# EAGLE design Luminode_Controller_Mark_II (EAGLE 6.6.0)
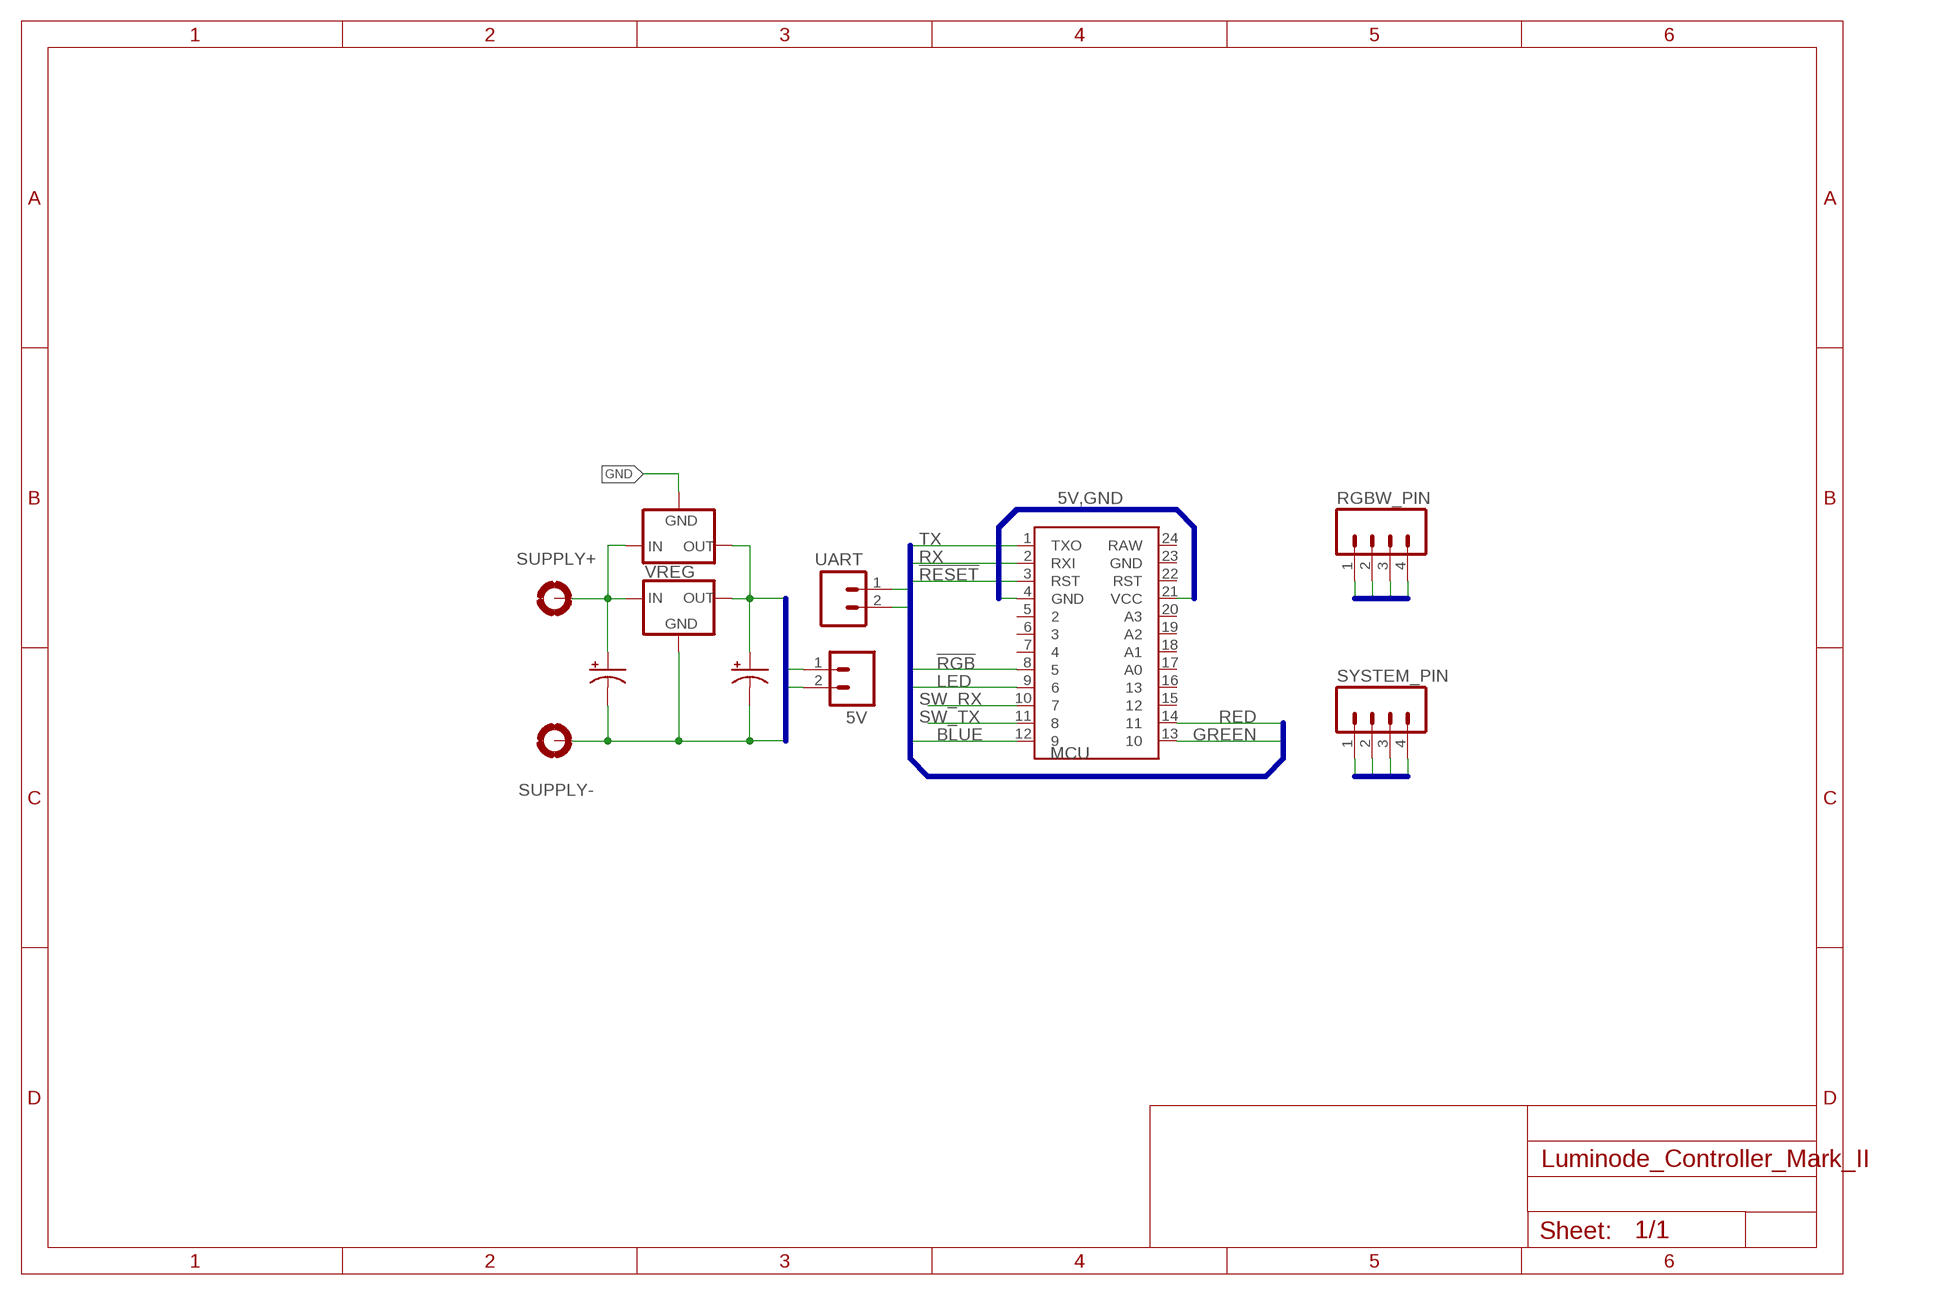
[diagram p0: schematic, sheet 1]

## Parts
5V  M02PTH  [1X02]
C_IN  CPOL-USSMCB  [SMC_B]
C_OUT  CPOL-USSMCB  [SMC_B]
MCU  ARDUINO_MINI  [ARDUINO_MINI]
RGBW_PIN  M04PTH  [1X04]
SUPPLY+  +V  MOUNT-PAD-ROUND3.0  [3,0-PAD]
SUPPLY-  -V  MOUNT-PAD-ROUND3.0  [3,0-PAD]
SYSTEM_PIN  M04PTH  [1X04]
UART  M02PTH  [1X02]
VREG  7805  LM1117  [SOT223]
VREG_ALT  V_REG_78XXSINK  [TO220-IGO]

## Nets
5V: 5V.1 C_OUT.+ MCU.21(VCC) SYSTEM_PIN.1 VREG.2(OUT) VREG_ALT.OUT
!RESET: MCU.3(RST)
!RGB: MCU.8 SYSTEM_PIN.4
BLUE: MCU.12 RGBW_PIN.3
GND [SUPPLY]: 5V.2 C_IN.- C_OUT.- MCU.4(GND) SUPPLY-.B3,0(MOUNT) SYSTEM_PIN.3 VREG.1(GND) VREG_ALT.GND
GREEN: MCU.13 RGBW_PIN.2
LED: MCU.9 RGBW_PIN.4
RED: MCU.14 RGBW_PIN.1
RX: MCU.2(RXI)
SW_RX: MCU.10 UART.2
SW_TX: MCU.11 UART.1
TX: MCU.1(TXO)
VIN: C_IN.+ SUPPLY+.B3,0(MOUNT) SYSTEM_PIN.2 VREG.3(IN) VREG_ALT.IN
Unconnected: MCU.5 MCU.6 MCU.7 MCU.15 MCU.16 MCU.17(A0) MCU.18(A1) MCU.19(A2) MCU.20(A3) MCU.22(RST) MCU.23(GND) MCU.24(RAW)

## Buses
5V,GND
TX,RX,!RESET,SW_TX,SW_RX,LED,!RGB,RED,GREEN,BLUE
RED,GREEN,BLUE,LED
VIN,5V,GND,!RGB

## Library data of the parts
5V UART = SparkFun:M02: Header 2 Standard 2-pin 0.1" header. Use with straight break away headers (SKU : PRT-00116), right angle break away headers (PRT-00553), swiss pins (PRT-00743), machine pins (PRT-00117), and female headers (PRT-00115). Molex polarized connector foot print use with SKU : PRT-08233 with associated crimp pins and housings.
C_IN C_OUT = rcl:CPOL-US: POLARIZED CAPACITOR, American symbol
MCU = SparkFun-Boards:ARDUINO_MINI: Arduino Pro Mini footprint
RGBW_PIN SYSTEM_PIN = SparkFun:M04: Header 4 Standard 4-pin 0.1" header. Use with straight break away headers (SKU : PRT-00116), right angle break away headers (PRT-00553), swiss pins (PRT-00743), machine pins (PRT-00117), and female headers (PRT-00115). Molex polarized connector foot print use with SKU : PRT-08231 with associated crimp pins and housings.
SUPPLY+ SUPPLY- = holes:MOUNT-PAD-ROUND: MOUNTING PAD, round
VREG = v-reg-2:LM1117
VREG_ALT = SparkFun:V_REG_78XX: Voltage Regulator Standard 7805 5V regulator. IGO (Input Ground Output). Spark Fun Electronics SKU : COM-00107

## Net classes
0 default: width 0.508 mm, clearance 0.508 mm
1 HIGH CURRENT: width 0.61 mm, clearance 0.61 mm
3 SUPPLY: width 0.813 mm, drill 0.61 mm, clearance 0.61 mm

## Board
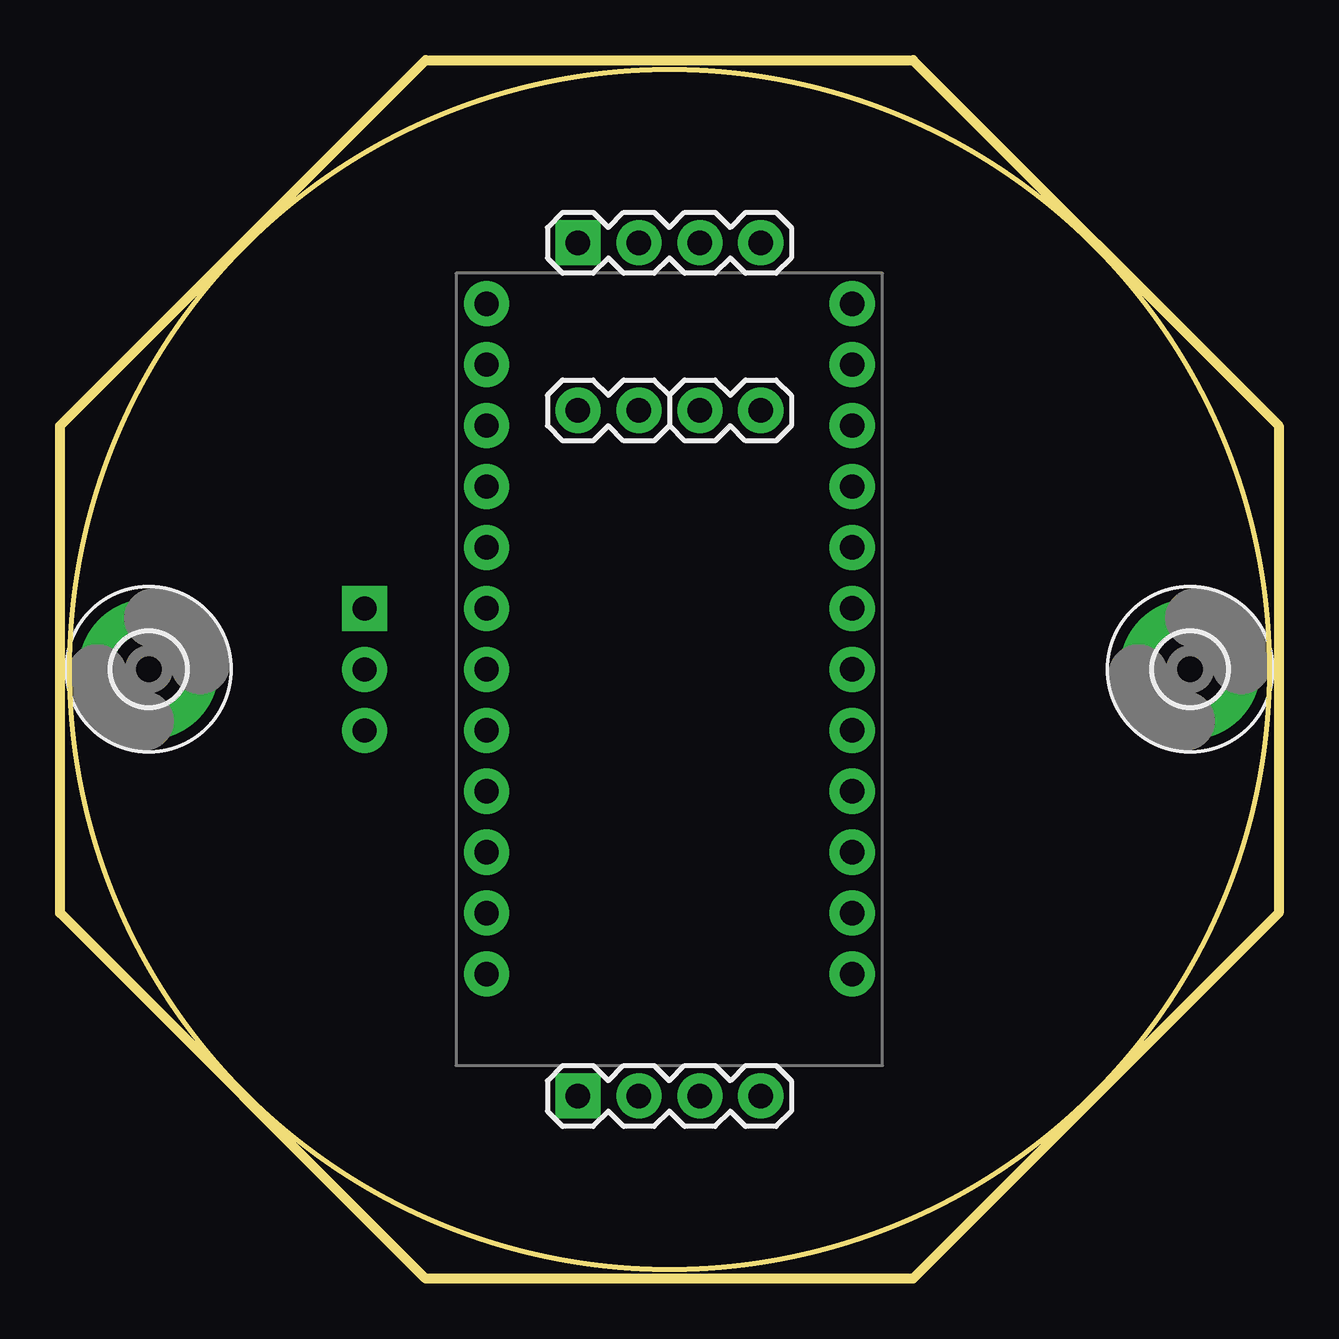
[diagram p1: board, top side]
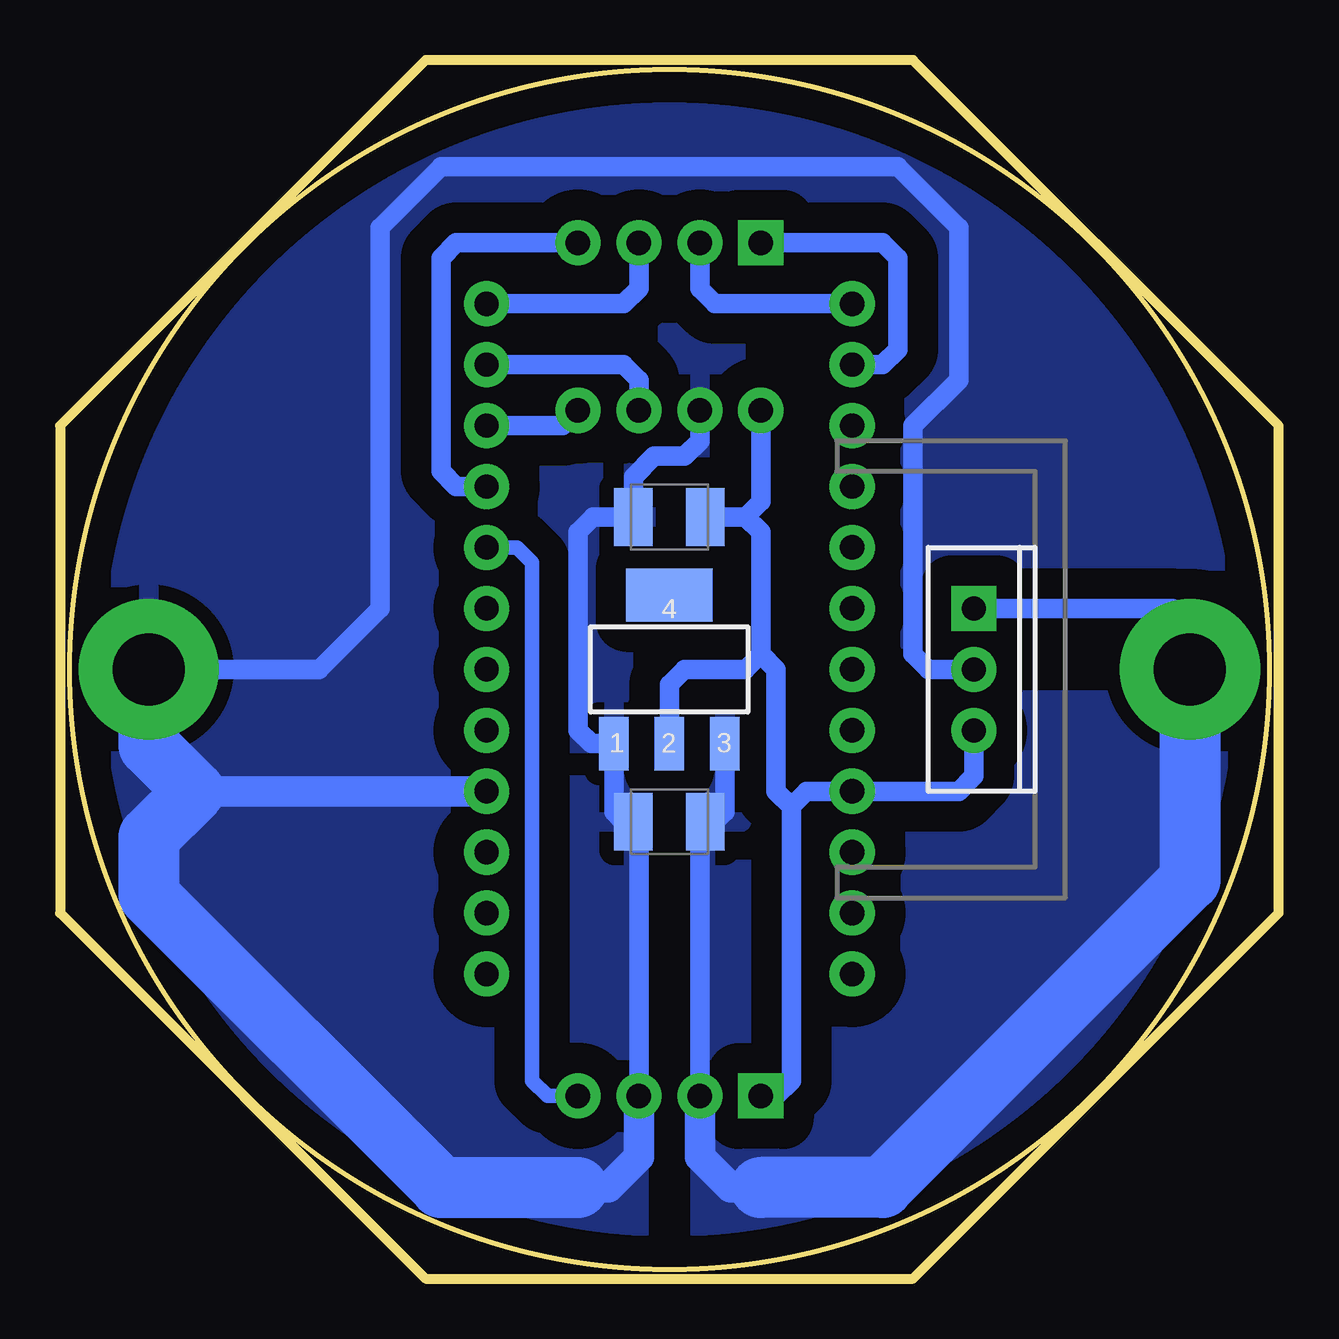
[diagram p2: board, bottom side, seen from below]

Size 50.8 x 50.8 mm. Coordinates in mm from the lower left corner, seen from the top.
Outline: 0,35.56 15.24,50.8 35.56,50.8 50.8,35.56 50.8,15.24 35.56,0 15.24,0 0,15.24 0,35.56
Outline: circle at 25.4,25.4 radius 25
Copper layers (1*16): Top 0.035mm / dielectric 1.5mm / Bottom 0.035mm
Design rules "default *": minimum track width 10mil, minimum drill 24mil, track to track 8mil, track to pad 20mil, pad to pad 8mil, via to via 24mil, smd to smd 8mil, copper to edge 40mil, drill to drill 8mil, minimum pad ring 10mil, minimum via ring 8mil, stop-mask expansion 4mil, vias tented up to drill 0mil, thermal gap 24mil

### Footprints (pad centres in the part's own frame; a part is rotated, then mirrored left to right if it is on the bottom)
1X02 = drill 1.016 pad 1.88: 1 0,0; 2 2.54,0
SMC_B = smd 1.6 x 2.4: + -1.5,0; - 1.5,0
ARDUINO_MINI = drill 1.016 pad 1.88: 1 -7.62,12.7; 2 -7.62,10.16; 3 -7.62,7.62; 4 -7.62,5.08; 5 -7.62,2.54; 6 -7.62,0; 7 -7.62,-2.54; 8 -7.62,-5.08; 9 -7.62,-7.62; 10 -7.62,-10.16; 11 -7.62,-12.7; 12 -7.62,-15.24; 13 7.62,-15.24; 14 7.62,-12.7; 15 7.62,-10.16; 16 7.62,-7.62; 17 7.62,-5.08; 18 7.62,-2.54; 19 7.62,0; 20 7.62,2.54; 21 7.62,5.08; 22 7.62,7.62; 23 7.62,10.16; 24 7.62,12.7
1X04 = drill 1.016 pad 1.88 square: 1 0,0 | drill 1.016 pad 1.88: 2 2.54,0; 3 5.08,0; 4 7.62,0
3,0-PAD = drill 3 pad 5.842: B3,0 0,0
SOT223 = smd 1.219 x 2.235: 1 -2.311,-3.099; 2 0,-3.099; 3 2.311,-3.099 | smd 3.6 x 2.2: 4 0,3.099
TO220-IGO = drill 1 pad 1.88: GND 0,0; OUT 2.54,0 | drill 1 pad 1.88 square: IN -2.54,0

### Placement (x,y rotation side)
5V  21.59,36.2 0 top
C_IN  25.4,19.05 180 bottom
C_OUT  25.4,31.75 180 bottom
MCU  25.4,25.4 180 top
RGBW_PIN  21.59,43.18 0 top
SUPPLY+  3.7,25.4 0 top
SUPPLY-  47.1,25.4 180 top
SYSTEM_PIN  21.59,7.62 0 top
UART  26.67,36.2 0 top
VREG  25.4,25.4 0 bottom
VREG_ALT  12.7,25.4 270 bottom

### Tracks (layer width: path | path; a pad name or v marks a point on that pad's centre or on a via)
5V
  Bottom 0.813: 5V.1 21.59,32.38 22.22,31.75 | 22.22,31.75 C_OUT.+ | VREG.2 25.4,24.76 24.76,25.4 22.22,25.4 21.59,26.04 | 22.22,31.75 21.59,31.11 21.59,26.04 | 20.32,19.68 20.32,8.25 20.95,7.62 SYSTEM_PIN.1 | 20.32,19.68 19.68,20.32 MCU.21 13.33,20.32 12.7,20.95 VREG_ALT.OUT | 20.32,19.68 20.95,20.32 20.95,25.4 21.59,26.04
!RGB
  Bottom 0.61: MCU.8 31.75,30.48 31.11,29.84 31.11,8.25 30.48,7.62 SYSTEM_PIN.4
BLUE
  Bottom 0.813: MCU.12 27.3,40.64 26.67,41.27 RGBW_PIN.3
GND
  Bottom 0.813: 5V.2 24.13,34.92 24.76,34.29 26.04,34.29 26.9,33.42 C_OUT.- 28.57,31.75 29.21,31.11 29.21,22.86 28.65,22.3 VREG.1 27.71,19.46 27.3,19.05 C_IN.- 26.67,18.82 SYSTEM_PIN.3 | SUPPLY-.B3,0 40,25.4 37.46,27.94 37.46,43.81 34.92,46.35 15.87,46.35 13.33,43.81 13.33,37.46 15.24,35.56 15.24,26.04 14.6,25.4 VREG_ALT.GND
  Bottom 1.27: MCU.4 45.2,20.32 | 29.21,3.81 27.94,3.81 26.67,5.08 SYSTEM_PIN.3
  Bottom 2.54: SUPPLY-.B3,0 47.1,22.22 45.2,20.32 47.1,18.41 47.1,15.98 34.92,3.81 29.21,3.81
  pour Bottom (isolate 1.27): 50.8,35.56 35.56,50.8 15.24,50.8 0,35.56 0,26.67 26.67,26.67 26.67,0 35.56,0 50.8,15.24
GREEN
  Bottom 0.813: MCU.13 23.49,40.64 24.13,41.27 RGBW_PIN.2
LED
  Bottom 0.813: MCU.9 34.29,33.02 34.92,33.66 34.92,42.55 34.29,43.18 RGBW_PIN.4
RED
  Bottom 0.813: MCU.14 16.51,38.1 15.87,38.73 15.87,42.55 16.51,43.18 RGBW_PIN.1
SW_RX
  Bottom 0.813: MCU.10 29.84,35.56 UART.2
SW_TX
  Bottom 0.813: MCU.11 27.3,38.1 26.67,37.46 UART.1
VIN
  Bottom 0.813: VREG.3 23.09,19.46 23.49,19.05 C_IN.+ 24.13,18.82 SYSTEM_PIN.2 | SUPPLY+.B3,0 3.7,27.2 4.45,27.94 VREG_ALT.IN
  Bottom 1.27: 21.59,3.81 22.86,3.81 24.13,5.08 SYSTEM_PIN.2
  Bottom 2.54: SUPPLY+.B3,0 3.7,16.62 16.51,3.81 21.59,3.81
  pour Bottom (isolate 1.27): 24.13,24.13 0.63,24.13 0,23.49 0,15.24 15.24,0 24.13,0